# Altium schematic sheet MCP73831T-5ACI.SchDoc
size A4
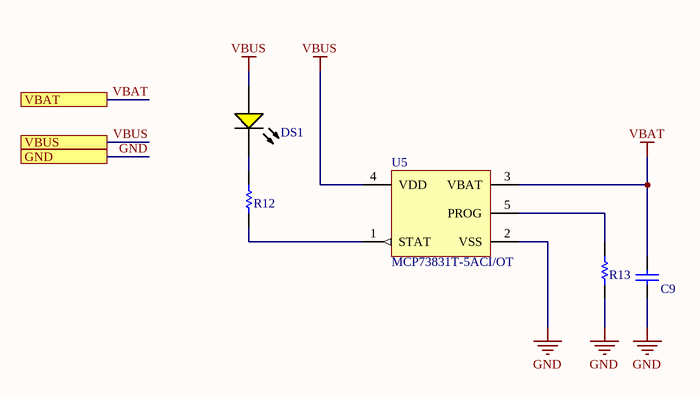
[diagram p0: MCP73831T-5ACI.SchDoc]

## Parts
C9  C0805C106K4PACTU  [CAPC2013X140X50NL20T25]  (value not drawn)
DS1  LTST-C150KSKT  [LTST-C150KSKT_V]  (value not drawn)
R12  ERJ-P06J102V  [RESC2013X70X40NL20T20]  (value not drawn)
R13  RC0805JR-074K7L  [RESC2013X60X30NL20T20]  (value not drawn)
U5  MCP73831T-5ACI/OT  [SOT-23-OT5_N]

## Ports
GND, VBAT, VBUS

## Nets
GND: C9.2 R13.2 U5.2(VSS) ; port GND
VBAT: C9.1 U5.3(VBAT) ; port VBAT
VBUS: DS1.1(A) U5.4(VDD) ; port VBUS
NetDS1_2: DS1.2(K) R12.2
NetR12_1: R12.1 U5.1(STAT)
NetR13_1: R13.1 U5.5(PROG)

## Library data of the parts
C9 = CMP-2007-03242-1: 10µF ±10% 16V Ceramic Capacitor X5R 0805 (2012 Metric); Part Number: CL21A106KOQNNNG
DS1 = CMP-2000-06618-1: LED Yellow, 75 mW, 80 mA, -55 to 85 degC, 2-Pin SMD, RoHS, Tape and Reel; Manufacturer: Lite-On; Forward Current: 30mA; Product Depth (mm): 1.6mm; DELETED: Compliant; Product Length (mm): 3.2mm; Type: Uni-Color; Product Height (mm): 1.1mm; Viewing Angle: 130deg; Number of  Elements: 1; Main Category: ChipLED; Forward Voltage: 2.4V; Test Current (It): 20mA; Shape Type: Rectangular; Chip Material: AlGaInP; Rad Hardened: No; Emitting Color: Amber; Luminous Intensity: 60mcd; High Brightness: Yes; Dominant Wave Length: 587nm; Reverse Voltage: 5V; Peak Wavelength: 588nm; Power Dissipation: 75W; Packaging: TapeandReel; Lens Dimensions: 2.06X1.6X0.6mm; Operating Temp Range: -55Cto85C; Pin Count: 2; Datasheet Version: Rev. E, 02/2005; Package Description: 2-Pin Surface Mount Device, Body 3.2 x 1.6 mm; Mounting: SurfaceMount; Datasheet URL: http://optoelectronics.liteon.com/upload/download/DS-22-99-0187/S_110_LTST-C150KSKT.pdf; Package Reference: C150KSKT; Manufacturer URL: http://www.us.liteon.com/; Operating Temperature Classification: Industrial; Package Type: ChipLed; Mounting Technology: SurfaceMount; Lum Intensity: 60mcd
R12 = CMP-2001-00477-1: RES SMD 1K OHM 5% 1/2W 0805; Manufacturer: Panasonic; Part Number: ERJ-P06J102V
R13 = RC0805JR-074K7L: 4.7 kOhms ±5% 0.125W, 1/8W Chip Resistor 0805 (2012 Metric) Moisture Resistant Thick Film; Manufacturer: Yageo; Part Number: RC0805JR-074K7L
U5 = CMP-0133-00136-1: Miniature Single-Cell, Fully Integrated Li-Ion, Li-Polymer Charge Management Controller, 4.5V, 5-Pin SOT-23, Industrial Temperature, Tape and Reel; PackageReference: SOT-23-OT5; PackageDescription: 5-Lead Plastic Small Outline Transistor (OT) [SOT-23]; PackageVersion: revBB, Aug-2009; DatasheetVersion: revE, Sep-2008; Code_IPC: SOT23-5